# EAGLE design Tweetronic_Relay_Board (EAGLE 7.1.0)
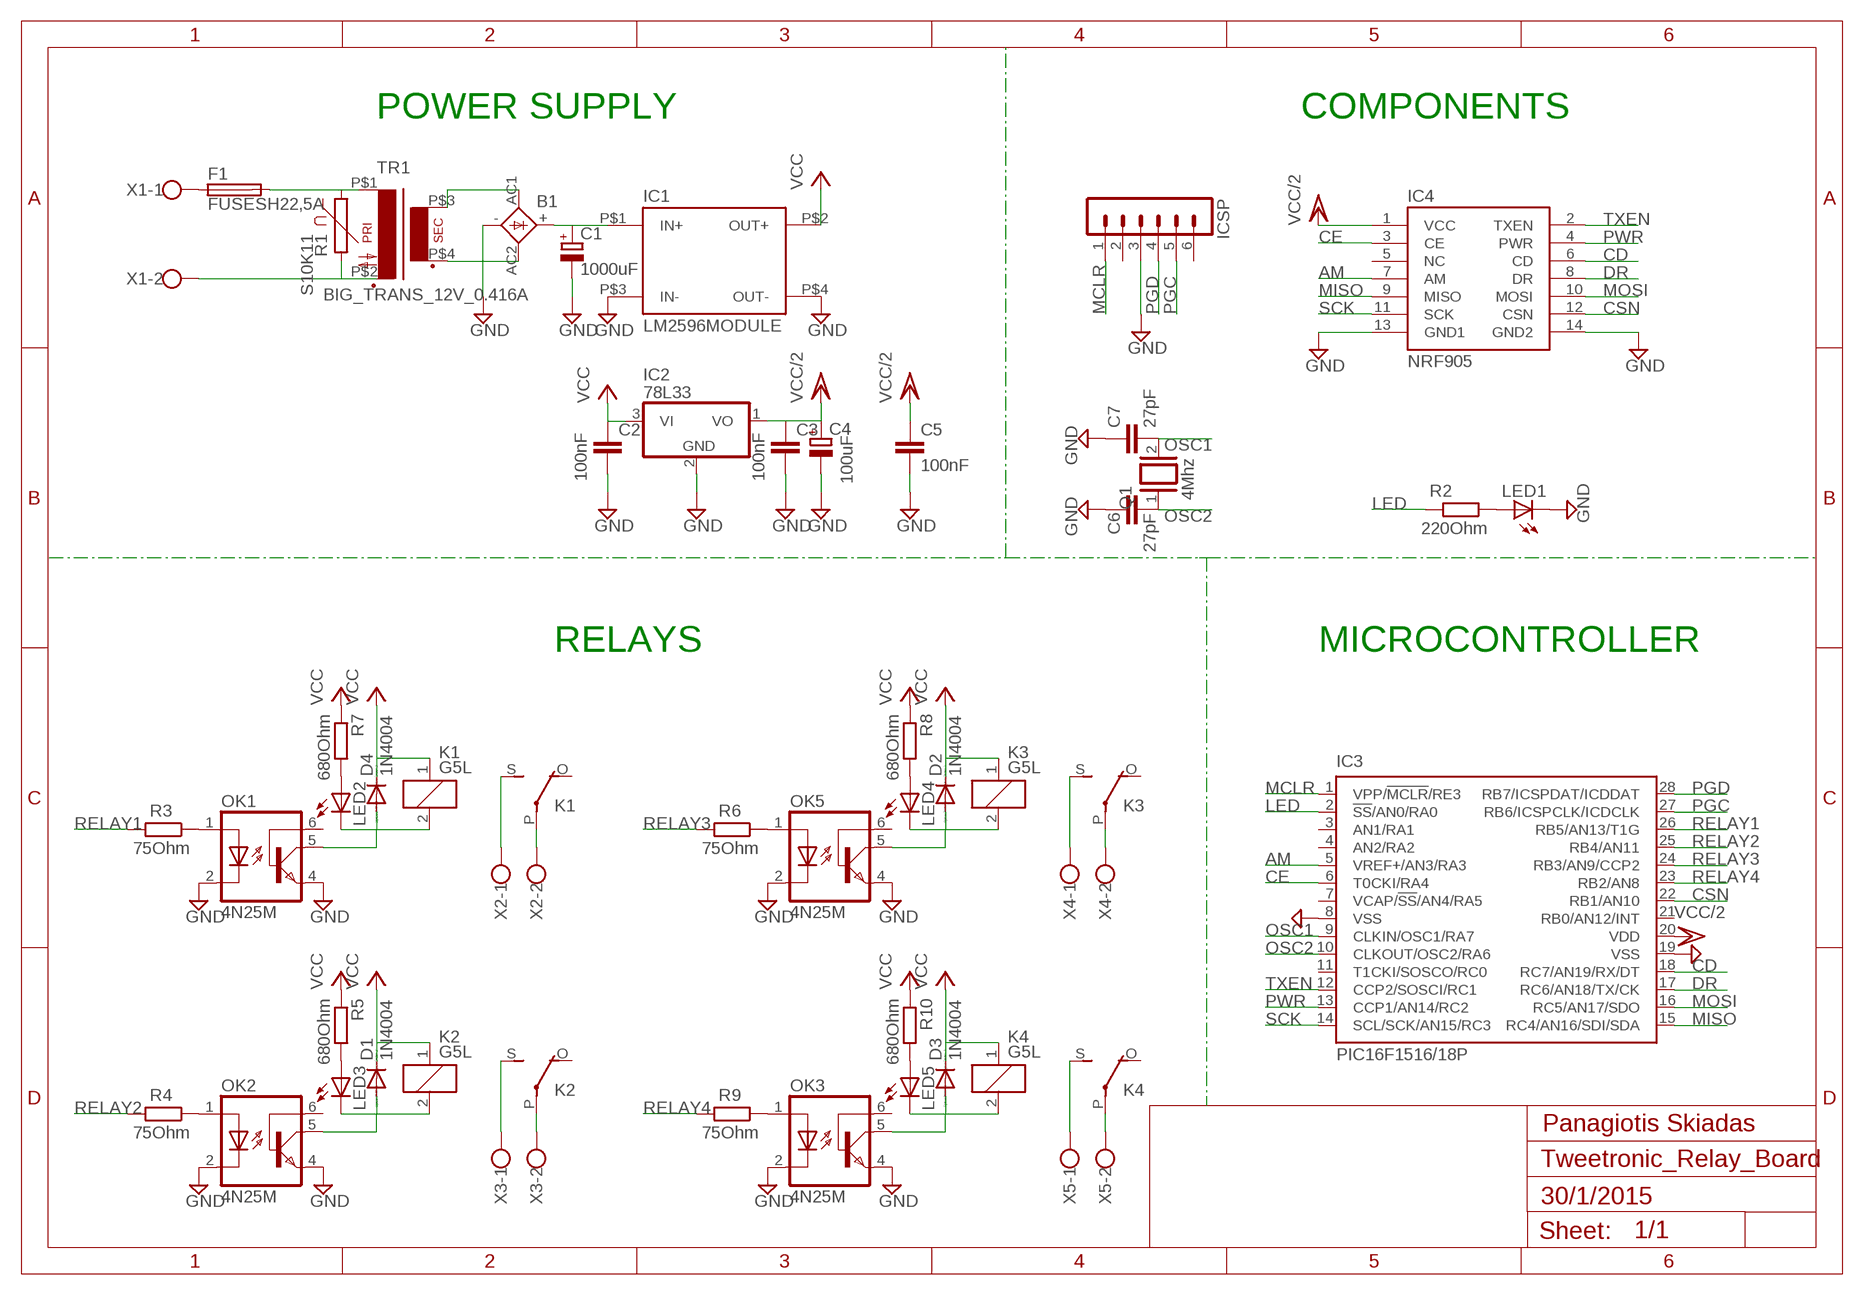
[diagram p0: schematic, sheet 1]

## Parts
B1  1KAB  [1KAB]
C1  1000uF  CPOL-EUE5-13  [E5-13]
C2  100nF  C5/3  [C5B3]
C3  100nF  C5/3  [C5B3]
C4  100uF  CPOL-EUE3.5-8  [E3,5-8]
C5  100nF  C5/3  [C5B3]
C6  27pF  C2,5-3  [C2.5-3]
C7  27pF  C2,5-3  [C2.5-3]
D1  1N4004  [DO41-10]
D2  1N4004  [DO41-10]
D3  1N4004  [DO41-10]
D4  1N4004  [DO41-10]
F1  FUSESH22,5A  [SH22,5A]
IC1  LM2596MODULE  [MODULE]
IC2  78L33  78L05Z  [TO92]
IC3  PIC16F1516/18P  [DIL28-3]
IC4  NRF905  [2X07]
ICSP  MA06-1  [MA06-1]
K1  G5L  [G5LE]
K2  G5L  [G5LE]
K3  G5L  [G5LE]
K4  G5L  [G5LE]
LED1  LED5MM  [LED5MM]
LED2  LED3MM  [LED3MM]
LED3  LED3MM  [LED3MM]
LED4  LED3MM  [LED3MM]
LED5  LED3MM  [LED3MM]
OK1  4N25M  [DIL06]
OK2  4N25M  [DIL06]
OK3  4N25M  [DIL06]
OK5  4N25M  [DIL06]
Q1  4Mhz  XTAL/S  [QS]
R1  S10K11  [S10K11]
R2  220Ohm  R-EU_0207/10  [0207/10]
R3  75Ohm  R-EU_0207/10  [0207/10]
R4  75Ohm  R-EU_0207/10  [0207/10]
R5  680Ohm  R-EU_0207/10  [0207/10]
R6  75Ohm  R-EU_0207/10  [0207/10]
R7  680Ohm  R-EU_0207/10  [0207/10]
R8  680Ohm  R-EU_0207/10  [0207/10]
R9  75Ohm  R-EU_0207/10  [0207/10]
R10  680Ohm  R-EU_0207/10  [0207/10]
TR1  BIG_TRANS_12V_0.416A  [BIG_TRANSF_12V_0.416A]
X1  W237-102  [W237-102]
X2  W237-102  [W237-102]
X3  W237-102  [W237-102]
X4  W237-102  [W237-102]
X5  W237-102  [W237-102]

## Nets
AM: IC3.5(VREF+/AN3/RA3) IC4.7(AM)
CD: IC3.18(RC7/AN19/RX/DT) IC4.6(CD)
CE: IC3.6(T0CKI/RA4) IC4.3(CE)
CSN: IC3.22(RB1/AN10) IC4.12(CSN)
DR: IC3.17(RC6/AN18/TX/CK) IC4.8(DR)
GND: B1.- C1.- C2.2 C3.2 C4.- C5.2 C6.1 C7.1 IC1.P$3(IN-) IC1.P$4(OUT-) IC2.2(GND) IC3.8(VSS) IC3.19(VSS) IC4.13(GND1) IC4.14(GND2) ICSP.3 LED1.K(C) OK1.2(C) OK1.4(EMI) OK2.2(C) OK2.4(EMI) OK3.2(C) OK3.4(EMI) OK5.2(C) OK5.4(EMI)
LED: IC3.2(!SS!/AN0/RA0) R2.2
MCLR: IC3.1(VPP/!MCLR!/RE3) ICSP.1
MISO: IC3.15(RC4/AN16/SDI/SDA) IC4.9(MISO)
MOSI: IC3.16(RC5/AN17/SDO) IC4.10(MOSI)
N$1: F1.1 X1.1
N$2: F1.2 R1.1 TR1.P$1(P1)
N$3: R1.2 TR1.P$2(P2) X1.2
N$4: B1.AC2 TR1.P$4(S3)
N$5: B1.AC1 TR1.P$3(S4)
N$6: B1.+ C1.+ IC1.P$1(IN+)
N$8: OK5.1(A) R6.1
N$9: LED1.A R2.1
N$10: OK1.1(A) R3.1
N$11: OK2.1(A) R4.1
N$12: D1.A K2.2 LED3.K(C) OK2.5(COL)
N$14: LED3.A R5.2
N$15: K2.S(2:S) X3.1
N$16: K2.P(2:P) X3.2
N$17: D4.A K1.2 LED2.K(C) OK1.5(COL)
N$18: OK3.1(A) R9.1
N$20: LED2.A R7.2
N$21: K1.S(2:S) X2.1
N$22: K1.P(2:P) X2.2
N$23: D2.A K3.2 LED4.K(C) OK5.5(COL)
N$25: LED4.A R8.2
N$26: K3.S(2:S) X4.1
N$27: K3.P(2:P) X4.2
N$29: D3.A K4.2 LED5.K(C) OK3.5(COL)
N$31: LED5.A R10.2
N$32: K4.S(2:S) X5.1
N$33: K4.P(2:P) X5.2
OSC1: C7.2 IC3.9(CLKIN/OSC1/RA7) Q1.2
OSC2: C6.2 IC3.10(CLKOUT/OSC2/RA6) Q1.1
PGC: IC3.27(RB6/ICSPCLK/ICDCLK) ICSP.5
PGD: IC3.28(RB7/ICSPDAT/ICDDAT) ICSP.4
PWR: IC3.13(CCP1/AN14/RC2) IC4.4(PWR)
RELAY1: IC3.26(RB5/AN13/T1G) R3.2
RELAY2: IC3.25(RB4/AN11) R4.2
RELAY3: IC3.24(RB3/AN9/CCP2) R6.2
RELAY4: IC3.23(RB2/AN8) R9.2
SCK: IC3.14(SCL/SCK/AN15/RC3) IC4.11(SCK)
TXEN: IC3.12(CCP2/SOSCI/RC1) IC4.2(TXEN)
VCC: C2.1 D1.C D2.C D3.C D4.C IC1.P$2(OUT+) IC2.3(VI) K1.1 K2.1 K3.1 K4.1 R5.1 R7.1 R8.1 R10.1
VCC/2: C3.1 C4.+ C5.1 IC2.1(VO) IC3.20(VDD) IC4.1(VCC)
Unconnected: IC3.3(AN1/RA1) IC3.4(AN2/RA2) IC3.7(VCAP/!SS!/AN4/RA5) IC3.11(T1CKI/SOSCO/RC0) IC3.21(RB0/AN12/INT) IC4.5(NC) ICSP.2 ICSP.6 K1.O(2:O) K2.O(2:O) K3.O(2:O) K4.O(2:O) OK1.6(BAS) OK2.6(BAS) OK3.6(BAS) OK5.6(BAS)

## Notes on the sheet
- POWER SUPPLY | COMPONENTS
- RELAYS | MICROCONTROLLER
- Panagiotis Skiadas
- 30/1/2015

## Library data of the parts
B1 = rectifier:1KAB: RECTIFIER grid 5,08 x 5,08 mm
C1 C4 = rcl:CPOL-EU: POLARIZED CAPACITOR, European symbol
C2 C3 C5-C7 = capacitor-wima:C: CAPACITOR naming: grid - package width
D1-D4 = diode:1N4004: DIODE general purpose rectifier, 1 A
F1 = fuse:FUSE: Fuse; OC_FARNELL: unknown; OC_NEWARK: unknown
IC1 = lm2596_module:LM2596MODULE
IC2 = 78L33:78*: Positive VOLTAGE REGULATOR Source: http://cache.national.com/ds/LM/LM78L05.pdf http://www.fairchildsemi.com/ds/LM/LM7805.pdf
IC3 = microchip:PIC16*F1516/18: 28/40/44-Pin Flash Microcontrollers with nanoWatt XLP Technology PIC16F1516/1518 AND PIC16LF1516/1518 Source: www.microchip.com PIC16F1516.pdf
IC4 = nrf905:NRF905
ICSP = con-lstb:MA06-1: PIN HEADER; OC_FARNELL: unknown; OC_NEWARK: unknown
K1-K4 = relay:G5L: RELAY 1 x switch, 10 A/120 V AC, 8 A/30 V ADC, Omron; OC_FARNELL: unknown; OC_NEWARK: unknown
LED1-LED5 = led:LED: LED OSRAM: - CHIPLED LG R971, LG N971, LY N971, LG Q971, LY Q971, LO R971, LY R971 LH N974, LH R974 LS Q976, LO Q976, LY Q976 LO Q996 - Hyper CHIPLED LW Q18S LB Q993, LB Q99A, LB R99A - SideLED LS A670, LO A670, LY A670, LG A670, LP A670 LB A673, LV A673, LT A673, LW A673 LH A674 LY A675 LS A676, LA A676, LO A676, LY A676, LW A676 LS A679, LY A679, LG A679 - Hyper Micro SIDELED® LS Y876, LA Y876, LO Y876, LY Y876 LT Y87S - SmartLED LW L88C, LW L88S LB L89C, LB L89S, LG L890 LS L89K, LO L89K, LY L89K LS L896, LA L896, LO L896, LY L896 - TOPLED LS T670, LO T670, LY T670, LG T670, LP T670 LSG T670, LSP T670, LSY T670, LOP T670, LYG T670 LG T671, LOG T671, LSG T671 LB T673, LV T673, LT T673, LW T673 LH T674 LS T676, LA T676, LO T676, LY T676, LB T676, LH T676, LSB T676, LW T676 LB T67C, LV T67C, LT T67C, LS T67K, LO T67K, LY T67K, LW E67C LS E67B, LA E67B, LO E67B, LY E67B, LB E67C, LV E67C, LT E67C LW T67C LS T679, LY T679, LG T679 LS T770, LO T770, LY T770, LG T770, LP T770 LB T773, LV T773, LT T773, LW T773 LH T774 LS E675, LA E675, LY E675, LS T675 LS T776, LA T776, LO T776, LY T776, LB T776 LHGB T686 LT T68C, LB T68C - Hyper Mini TOPLED® LB M676 - Mini TOPLED Santana® LG M470 LS M47K, LO M47K, LY M47K Source: http://www.osram.convergy.de LUXEON: - LUMILED® LXK2-PW12-R00, LXK2-PW12-S00, LXK2-PW14-U00, LXK2-PW14-V00 LXK2-PM12-R00, LXK2-PM12-S00, LXK2-PM14-U00 LXK2-PE12-Q00, LXK2-PE12-R00, LXK2-PE12-S00, LXK2-PE14-T00, LXK2-PE14-U00 LXK2-PB12-K00, LXK2-PB12-L00, LXK2-PB12-M00, LXK2-PB14-N00, LXK2-PB14-P00, LXK2-PB14-Q00 LXK2-PR12-L00, LXK2-PR12-M00, LXK2-PR14-Q00, LXK2-PR14-R00 LXK2-PD12-Q00, LXK2-PD12-R00, LXK2-PD12-S00 LXK2-PH12-R00, LXK2-PH12-S00 LXK2-PL12-P00, LXK2-PL12-Q00, LXK2-PL12-R00 Source: www.luxeon.com KINGBRIGHT: KA-3528ASYC Source: www.kingbright.com
OK1-OK3 OK5 = optocoupler:4N*?M: General Purpose 6-Pin Phototransistor Optocouplers Source: http://www.fairchildsemi.com/ds/4N/4N35-M.pdf; MPN: 4N25-M; OC_FARNELL: 1021349; OC_NEWARK: 98K9084
Q1 = special:XTAL/S: CRYSTAL
R1 = varistor:S10K11: VARISTOR
R2-R10 = rcl:R-EU_: RESISTOR, European symbol
TR1 = trafo:BIG_TRANS_12V_0.416A
X1-X5 = con-wago-500:W237-102: WAGO SCREW CLAMP; MPN: 237-102; OC_FARNELL: unknown; OC_NEWARK: 70K9898

## Board
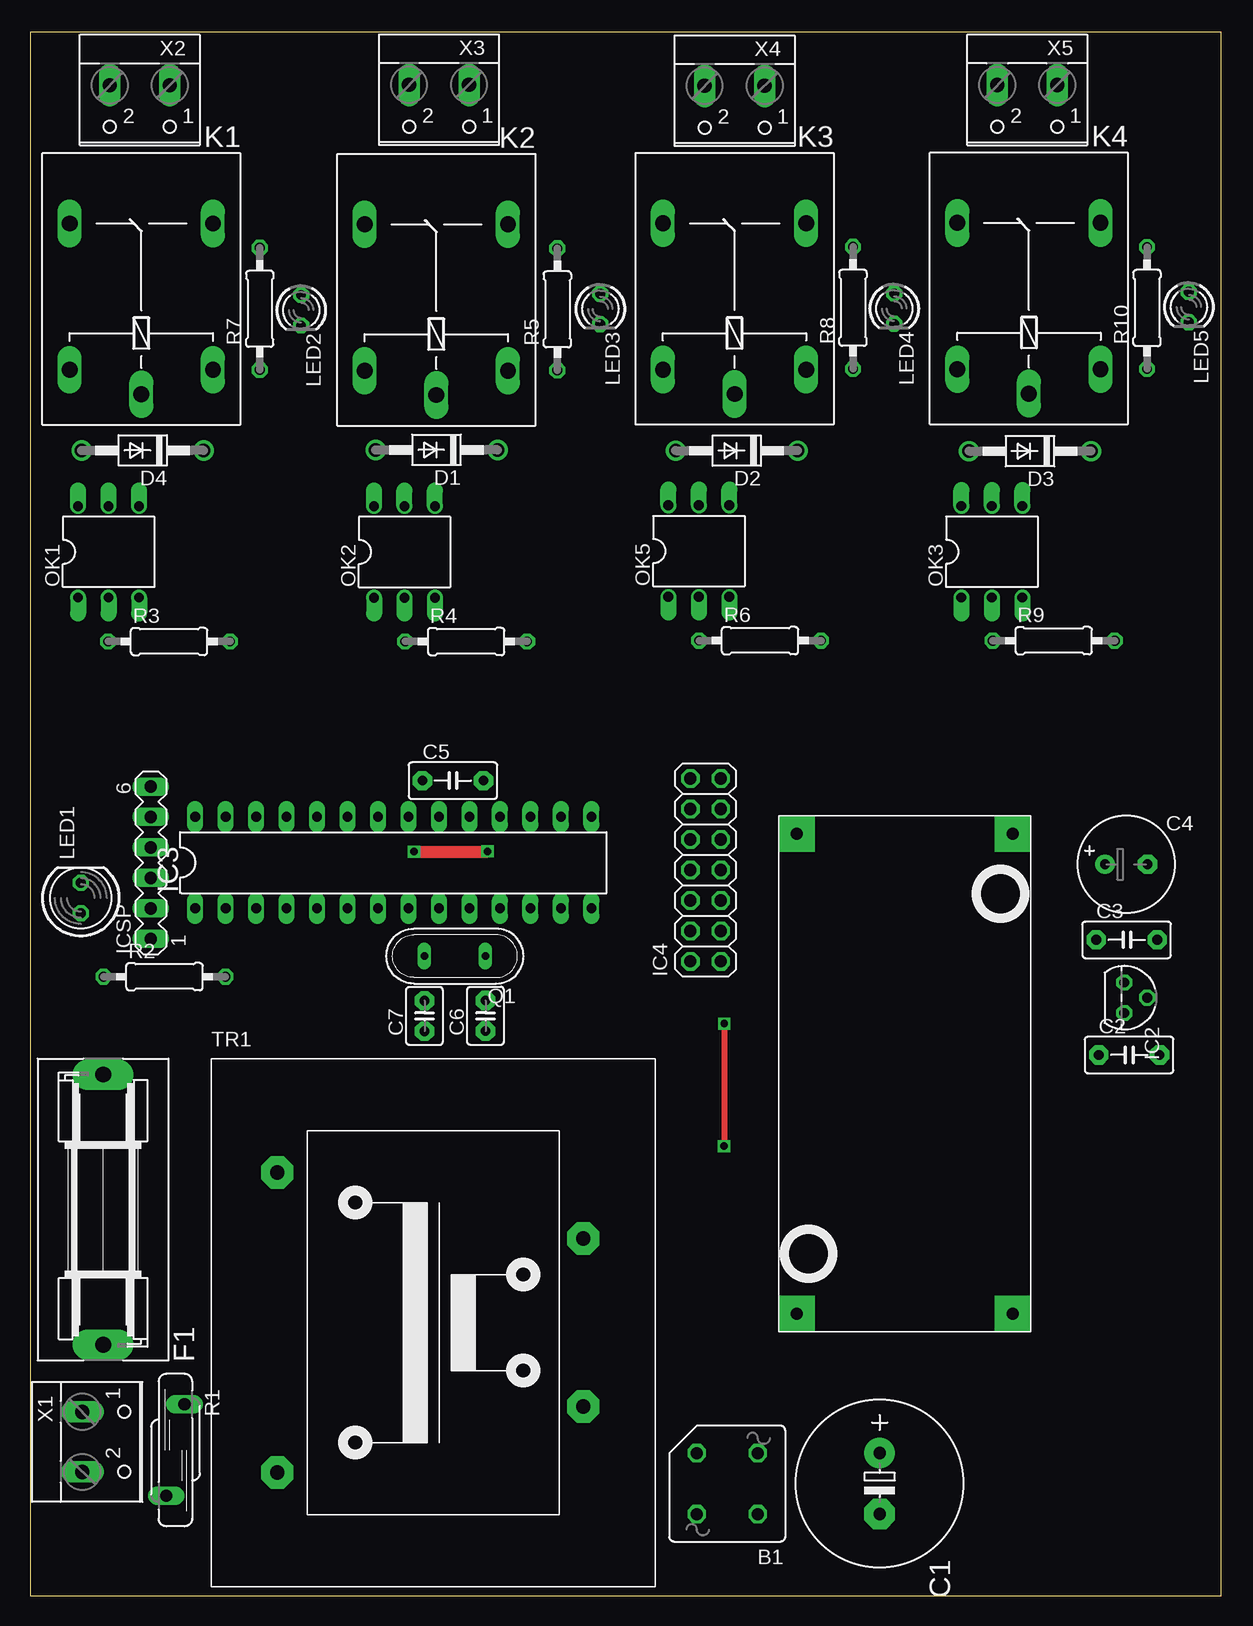
[diagram p1: board, top side]
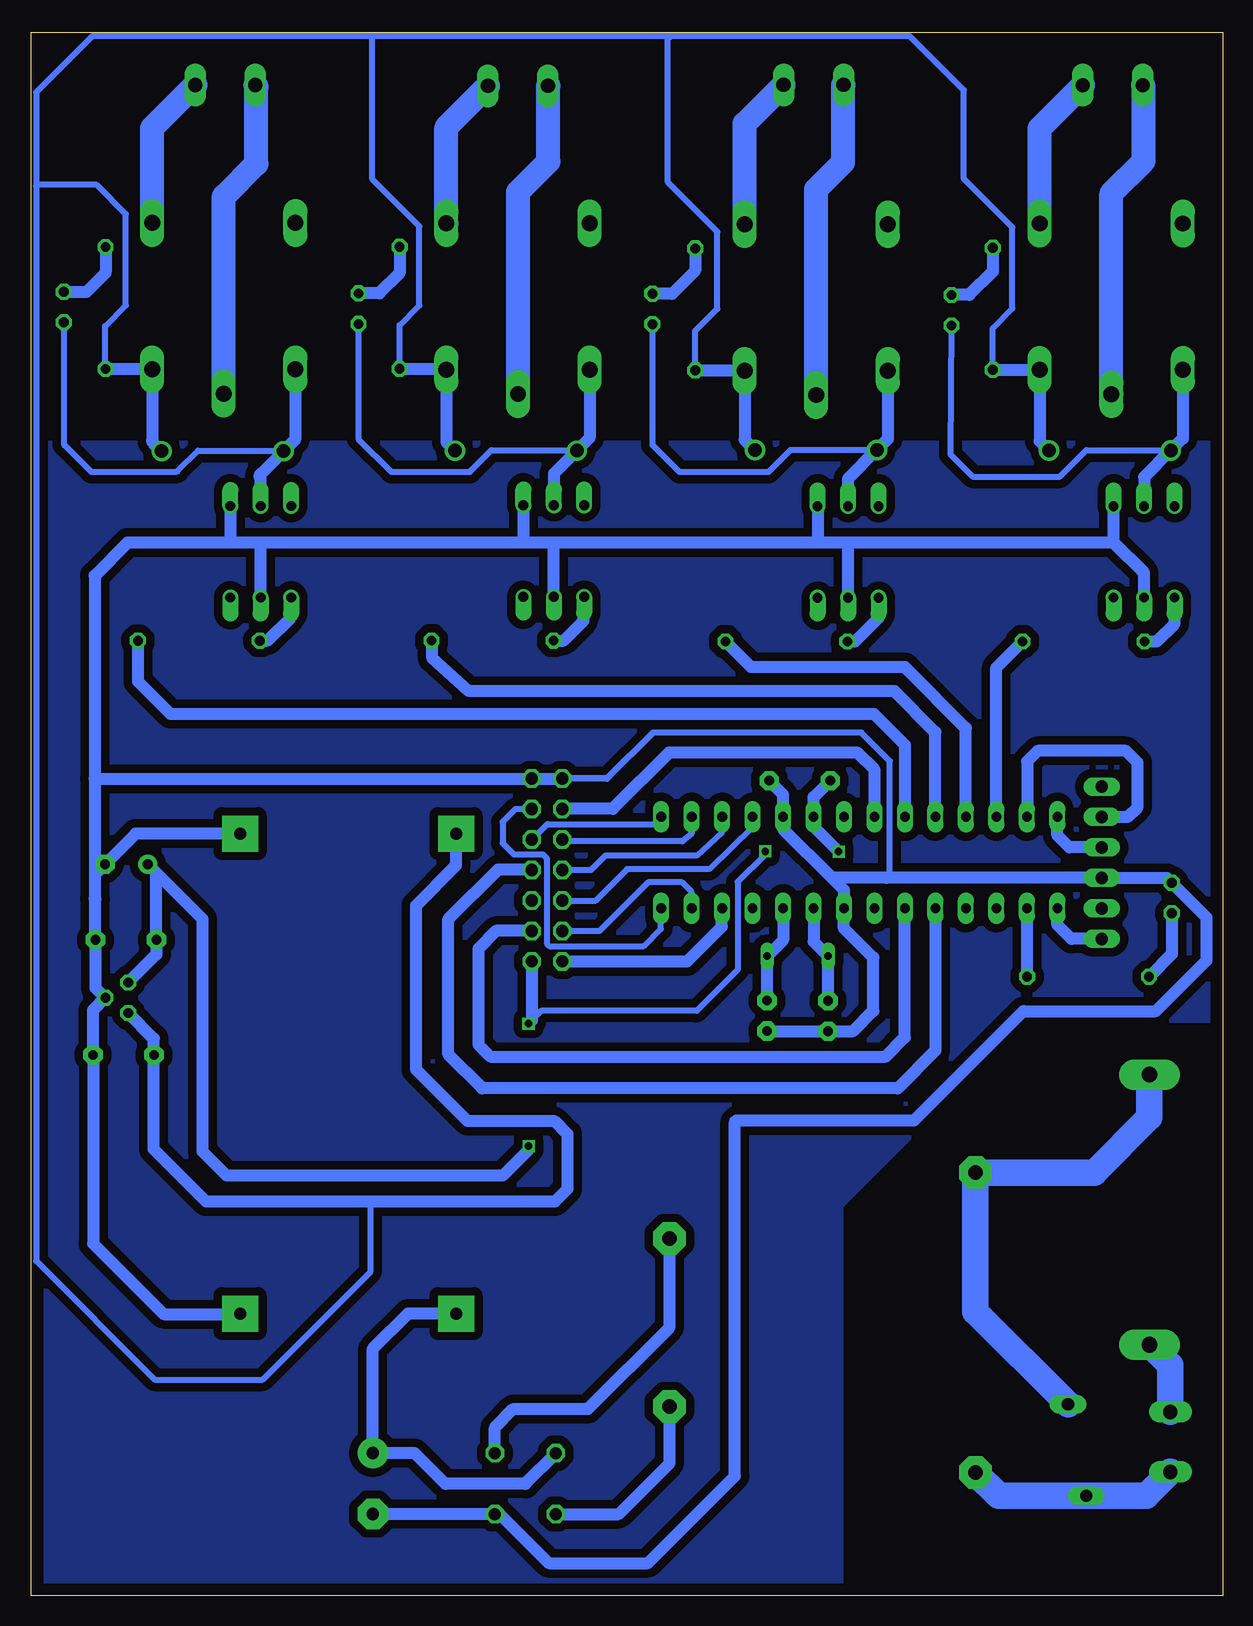
[diagram p2: board, bottom side, seen from below]

Size 99.29 x 130.29 mm. Coordinates in mm from the lower left corner, seen from the top.
Outline: 0,0 99.29,0 99.29,130.29 0,130.29 0,0
Copper layers (1*16): Top 0.035mm / dielectric 1.5mm / Bottom 0.035mm
Design rules "default": minimum track width 10mil, minimum drill 24mil, track to track 8mil, track to pad 8mil, pad to pad 8mil, via to via 8mil, smd to smd 8mil, copper to edge 40mil, drill to drill 8mil, minimum pad ring 10mil, minimum via ring 8mil, stop-mask expansion 4mil, vias tented up to drill 0mil, thermal gap 10mil

### Footprints (pad centres in the part's own frame; a part is rotated, then mirrored left to right if it is on the bottom)
1KAB = drill 1.016 octagon: + 2.54,-2.54; - -2.54,2.54; AC1 -2.54,-2.54; AC2 2.54,2.54
E5-13 = drill 1.016 pad 2.54: + -2.54,0 | drill 1.016 pad 2.54 octagon: - 2.54,0
C5B3 = drill 0.813 pad 1.6 octagon: 1 -2.54,0; 2 2.54,0
E3,5-8 = drill 0.813 pad 1.6: + -1.778,0 | drill 0.813 pad 1.6 octagon: - 1.778,0
C2.5-3 = drill 0.813 pad 1.6 octagon: 1 -1.27,0; 2 1.27,0
DO41-10 = drill 1.118: A 5.08,0; C -5.08,0
SH22,5A = drill 1.321 pad 2.54 long: 1 -11.252,0; 2 11.252,0
MODULE = drill 1 pad 3 square: P$1 -20.04,9.39; P$2 19.96,9.39; P$3 -20.04,-8.61; P$4 19.96,-8.61
TO92 = drill 0.813 octagon: 1 -1.27,0; 2 0,1.905; 3 1.27,0
DIL28-3 = drill 0.813 long: 1 -16.51,-3.81; 2 -13.97,-3.81; 3 -11.43,-3.81; 4 -8.89,-3.81; 5 -6.35,-3.81; 6 -3.81,-3.81; 7 -1.27,-3.81; 8 1.27,-3.81; 9 3.81,-3.81; 10 6.35,-3.81; 11 8.89,-3.81; 12 11.43,-3.81; 13 13.97,-3.81; 14 16.51,-3.81; 15 16.51,3.81; 16 13.97,3.81; 17 11.43,3.81; 18 8.89,3.81; 19 6.35,3.81; 20 3.81,3.81; 21 1.27,3.81; 22 -1.27,3.81; 23 -3.81,3.81; 24 -6.35,3.81; 25 -8.89,3.81; 26 -11.43,3.81; 27 -13.97,3.81; 28 -16.51,3.81
2X07 = drill 1.016 octagon: 1 -7.62,-1.27; 2 -7.62,1.27; 3 -5.08,-1.27; 4 -5.08,1.27; 5 -2.54,-1.27; 6 -2.54,1.27; 7 0,-1.27; 8 0,1.27; 9 2.54,-1.27; 10 2.54,1.27; 11 5.08,-1.27; 12 5.08,1.27; 13 7.62,-1.27; 14 7.62,1.27
MA06-1 = drill 1.016 long: 1 -6.35,0; 2 -3.81,0; 3 -1.27,0; 4 1.27,0; 5 3.81,0; 6 6.35,0
G5LE = drill 1.321 long: 1 -7.493,-5.969; 2 -7.493,5.969; O 4.699,5.969; P -9.525,0; S 4.699,-5.969
LED5MM = drill 0.813 octagon: A -1.27,0; K 1.27,0
LED3MM = drill 0.813 octagon: A -1.27,0; K 1.27,0
DIL06 = drill 0.813 offset: 1 -2.54,-3.81; 2 0,-3.81; 3 2.54,-3.81; 4 2.54,3.81; 5 0,3.81; 6 -2.54,3.81
QS = drill 0.61 long: 1 -2.54,0; 2 2.54,0
S10K11 = drill 1.016 long: 1 -0.762,-3.81; 2 0.762,3.81
0207/10 = drill 0.813 octagon: 1 -5.08,0; 2 5.08,0
BIG_TRANSF_12V_0.416A = drill 1.2 pad 2.7 octagon: P$1 -13.5,12.5; P$2 -13.5,-12.5; P$3 12,7; P$4 12,-7
W237-102 = drill 1.194 long: 1 -2.5,-1.27; 2 2.5,-1.27

### Placement (x,y rotation side)
B1  58.1,9.33 180 top
C1  70.81,9.34 270 top
C2  91.59,45.05 0 top
C3  91.39,54.64 0 top
C4  91.35,60.94 0 top
C5  35.24,67.91 0 top
C6  37.96,48.31 90 top
C7  32.88,48.3 90 top
D1  33.88,95.47 180 top
D2  58.89,95.41 180 top
D3  83.33,95.36 180 top
D4  9.39,95.42 180 top
F1  6.09,32.16 90 top
IC1  73.27,43.52 90 top
IC2  91.2,49.82 270 top
IC3  30.27,61.08 0 top
IC4  56.3,60.47 90 top
ICSP  10.07,61.07 90 top
K1  9.28,109.64 90 top
K2  33.86,109.57 90 top
K3  58.72,109.66 90 top
K4  83.24,109.69 90 top
LED1  4.24,58.13 90 top
LED2  22.59,107.11 270 top
LED3  47.52,107.22 270 top
LED4  72.01,107.24 270 top
LED5  96.56,107.37 270 top
OK1  6.55,86.97 0 top
OK2  31.21,86.97 0 top
OK3  80.15,86.98 0 top
OK5  55.74,87.04 0 top
Q1  35.41,53.28 180 top
R1  12.12,12.12 180 top
R2  11.21,51.57 0 top
R3  11.59,79.51 0 top
R4  36.35,79.5 0 top
R5  43.95,107.18 90 top
R6  60.84,79.58 0 top
R7  19.14,107.23 90 top
R8  68.58,107.31 90 top
R9  85.31,79.57 0 top
R10  93.09,107.3 90 top
TR1  34.1,22.74 0 top
X1  5.63,12.81 270 top
X2  9.15,124.59 180 top
X3  34.09,124.62 180 top
X4  58.72,124.54 180 top
X5  83.11,124.61 180 top

### Tracks (layer width: path | path; a pad name or v marks a point on that pad's centre or on a via)
AM
  Bottom 1: IC3.5 23.93,45.42 27.08,42.27 61.71,42.27 64.52,45.08 64.52,56.38 60.38,60.52 57.62,60.52 IC4.7
CD
  Bottom 0.5: IC3.18 39.16,64.05 42.79,60.53 49.62,60.53 52.24,57.91 55.02,57.91 IC4.6
CE
  Bottom 1: IC4.3 60.55,55.38 62.02,53.91 62.02,45.91 61.02,44.91 28.07,44.91 26.48,46.51 26.48,57.26 IC3.6
CSN
  Bottom 1: IC3.22 29,68.8 30.45,70.24 46.13,70.24 50.82,65.55 IC4.12
DR
  Bottom 0.5: IC3.17 41.7,63.61 43.82,61.66 51.43,61.66 52.62,60.46 IC4.8
GND
  Bottom 0.5: 28,59.8 27.72,60.08 27.72,69.53 30.11,71.92 47.44,71.92 | 47.44,71.92 51.3,68.06 55,68.06 IC4.14 | 47.44,71.92 47.48,71.92 51.3,68.1 54.97,68.1 55.04,68.03
  Bottom 1: C5.2 36.62,66.75 IC3.19 36.59,64.86 36.59,63.82 32.57,59.8 | IC3.8 31.55,58 | 31.55,58 31.55,58.77 32.57,59.8 | 32.57,59.8 28,59.8 ICSP.3 4.64,59.8 LED1.K 1.32,56.49 1.32,52.94 5.57,48.7 16.6,48.7 25.7,39.6 40.51,39.6 40.65,39.46 40.65,9.96 47.9,2.71 56.17,2.71 60.25,6.79 B1.- 70.8,6.79 C1.- | C6.1 C7.1 30.8,47.03 29.11,48.72 29.11,53.16 31.55,55.61 31.55,57.99 31.55,58 | IC4.13 IC4.14 | IC1.P$3 81.91,23.46 88.25,23.46 94.13,29.34 C2.2 94.13,48.79 IC2.2 93.93,50.65 C3.2 93.93,58 | 93.93,58 93.93,60.14 C4.- 90.59,63.48 IC1.P$4 | 94,68.09 94,85 91.26,87.74 83,87.74 | 94,68.09 94,58.07 93.93,58 | 55.04,68.03 93.94,68.03 94,68.09 | 9.07,87.74 9.07,87.7 6.55,85.17 OK1.2 6.55,85.22 9.07,87.74 | 9.07,87.74 9.07,90.77 OK1.4 | 9.07,87.74 31,87.74 | 31,87.74 34,87.74 | 34,87.74 56,87.74 | 56,87.74 58,87.74 | 58,87.74 80,87.74 | 80,87.74 83,87.74 | OK3.2 80.15,87.59 80,87.74 | OK3.4 82.69,88.05 83,87.74 | OK5.2 55.74,87.48 56,87.74 | OK5.4 58.28,88.02 58,87.74 | OK2.2 31.21,87.53 31,87.74 | OK2.4 33.75,87.99 34,87.74
LED
  Bottom 1: R2.2 IC3.2
MCLR
  Bottom 1: ICSP.1 12.59,54.72 13.77,55.89 IC3.1
MISO
  Bottom 0.5: IC4.9 57.54,63.01 56.26,64.28 47.4,64.28 IC3.15
MOSI
  Bottom 0.5: IC3.16 44.24,63.48 45.02,62.85 54.88,62.85 IC4.10 55.02,62.99
N$1
  Bottom 2.2: X1.1 4.36,19.18 F1.1
N$2
  Bottom 2.2: R1.1 20.6,23.65 TR1.P$1 10.7,35.24 6.1,39.84 F1.2
N$3
  Bottom 2.2: TR1.P$2 18.67,8.31 R1.2 6.35,8.31 X1.2
N$4
  Bottom 1: B1.AC2 50.34,6.79 46.08,11.04 46.08,15.73 TR1.P$4
N$5
  Bottom 1: B1.AC1 60.65,14 59.09,15.55 52.9,15.55 46.08,22.37 46.08,29.73 TR1.P$3
N$6
  Bottom 1: B1.+ 55.56,11.83 58.1,9.3 64.76,9.3 67.33,11.87 70.8,11.87 C1.+ 70.85,11.92 70.85,20.51 67.88,23.48 IC1.P$1
N$7
  pour Bottom (isolate 0.7): 0,96 99.27,96 99.27,0.01 31.82,0.01 31.82,32.46 16.31,47.98 0,47.98
N$8
  Bottom 1: R6.1 54.91,79.58 53.25,81.24 53.25,83.18 OK5.1
N$9
  Bottom 1: LED1.A 4.24,53.47 R2.1
N$10
  Bottom 1: R3.1 5.49,79.51 4,81 OK1.1
N$11
  Bottom 1: R4.1 30.63,79.5 28.68,81.45 28.68,83.14 OK2.1
N$12
  Bottom 0.5: LED3.K 47.52,95.88 45.28,93.64 37.83,93.64 36.01,95.47 D1.A
  Bottom 1: K2.2 27.89,96.38 D1.A 31.21,93.06 31.21,93.05 OK2.5
N$14
  Bottom 1: R5.2 43.95,110.41 45.88,108.48 47.51,108.48 LED3.A
N$15
  Bottom 2: K2.S 39.83,122.65 X3.1
N$16
  Bottom 2: K2.P 33.86,117.19 31.62,119.43 31.62,125.86 X3.2
N$17
  Bottom 0.5: LED2.K 22.68,95.09 20.84,93.24 13.56,93.24 11.36,95.44 4.33,95.44 D4.A
  Bottom 1: K1.2 3.31,96.42 D4.A 6.53,93.2 6.53,90.8 OK1.5
N$18
  Bottom 1: R9.1 79.6,79.57 77.63,81.54 77.63,83.16 OK3.1
N$20
  Bottom 1: R7.2 19.14,110.33 21.1,108.38 LED2.A
N$21
  Bottom 2: K1.S 15.25,122.27 X2.1
N$22
  Bottom 2: K1.P 9.28,116.84 6.58,119.54 6.58,125.79 X2.2
N$23
  Bottom 0.5: LED4.K 72.01,96.37 69.28,93.64 62.74,93.64 60.94,95.44 53.85,95.44 D2.A
  Bottom 1: K3.2 52.75,96.47 D2.A 55.73,93.48 OK5.5
N$25
  Bottom 1: R8.2 68.58,110.2 70.28,108.51 LED4.A
N$26
  Bottom 2: K3.S 64.68,122.35 X4.1
N$27
  Bottom 2: K3.P 58.72,116.97 56.19,119.5 56.19,125.78 X4.2
N$29
  Bottom 0.5: LED5.K 96.56,96.03 arc-45 96.49,95.85 94.28,93.64 87.25,93.64 arc-45 87.08,93.72 85.38,95.41 78.37,95.41 arc45 D3.A
  Bottom 1: K4.2 77.27,96.45 arc45 77.34,96.27 D3.A 80.17,93.45 arc-45 80.24,93.27 80.15,93.19 OK3.5
N$31
  Bottom 1: R10.2 93.09,110.33 arc45 93.16,110.15 94.69,108.62 96.52,108.62 arc45 LED5.A
N$32
  Bottom 2: K4.S 89.21,122.17 arc45 89.14,122.35 X5.1
N$33
  Bottom 2: K4.P 83.24,116.47 arc45 83.17,116.65 80.52,119.3 80.52,125.69 arc-45 80.59,125.87 X5.2
OSC1
  Bottom 1: IC3.9 34.09,54.49 Q1.2 C7.2
OSC2
  Bottom 1: IC3.10 36.62,54.61 Q1.1 C6.2
PGC
  Bottom 1: ICSP.5 7.91,64.88 7.08,65.71 7.08,69.41 8.06,70.4 15.41,70.4 16.3,69.51 16.3,64.9 IC3.27
PGD
  Bottom 1: ICSP.4 12.76,62.34 13.78,63.35 13.78,64.88 IC3.28
PWR
  Bottom 0.5: IC3.13 44.24,58.63 45.04,59.42 47.87,59.42 51.91,55.38 IC4.4
RELAY1
  Bottom 1: IC3.26 18.84,77.33 R3.2
RELAY2
  Bottom 1: IC3.25 21.39,72.29 26.33,77.24 26.33,77.25 26.45,77.37 39.29,77.37 R4.2
RELAY3
  Bottom 1: IC3.24 23.93,71.96 27.33,75.36 62.81,75.36 65.86,78.1 65.86,79.52 R6.2
RELAY4
  Bottom 1: IC3.23 26.46,70.87 28.97,73.37 29.06,73.46 87.67,73.46 90.37,76.16 90.37,79.55 R9.2
SCK
  Bottom 0.5: IC4.11 58.93,65.55 60,64.47 60,62.71 59.05,61.76 56.64,61.76 56.3,61.42 56.3,54.32 56.09,54.11 48.25,54.11 46.81,55.55 46.81,57.25 IC3.14
TXEN
  Bottom 1: IC4.2 44.63,52.84 41.73,55.74 41.73,57.25 IC3.12
VCC
  Bottom 0.5: R7.1 19.14,105.63 17.51,107.26 17.51,114.01 21.56,118.05 21.56,125.44 26.08,129.96 46,129.96 | 46,129.96 71,129.96 | 71,129.96 94.18,129.96 98.88,125.25 98.88,117.47 | 98.88,117.47 98.88,27.88 89,18 80,18 71,27 71,32.82 | R5.1 43.95,105.39 42.11,107.23 42.11,113.64 46.23,117.77 46.23,129.73 46,129.96 | R8.1 68.58,105.86 66.94,107.5 66.94,114.1 70.85,118.01 70.85,129.81 71,129.96 | K4.1 93.1,102.2 93.12,102.21 93.12,105.79 91.4,107.5 91.4,115.12 93.83,117.55 98.8,117.55 98.88,117.47
  Bottom 1: D4.C 15.25,96.2 K1.1 R7.1 | D1.C 39.83,96.33 K2.1 39.86,102.1 R5.1 | D2.C 64.68,96.12 K3.1 64.75,102.23 R8.1 | D3.C 89.14,96.08 arc45 89.21,96.26 K4.1 arc-45 89.26,102.22 R10.1 | IC2.3 89.05,46.41 C2.1 89.09,45.01 89.09,37.19 84.71,32.82 71,32.82 55.64,32.82 54.6,33.86 54.6,38.44 55.7,39.55 62.94,39.55 67.23,43.84 67.23,57.5 63.88,60.85 IC1.P$2
VCC/2  (via drill 0.6)
  Top 0.5: v57.84,47.66 57.84,37.47 v57.83,37.46
  Top 1: v32,62 v38.11,62 v38.12,62.01
  Bottom 0.5: v38.12,62.01 38.12,61.75 40.41,59.46 40.41,52.15 43.84,48.72 56.79,48.72 v57.84,47.66 | v57.83,37.46 57.83,37.17
  Bottom 1: IC2.1 88.85,53.44 C3.1 88.85,60.21 C4.+ 85,56.36 85,37 83,35 60,35 57.83,37.17 | C5.1 34.09,66.53 IC3.20 34.09,64.08 v32,62 | IC4.1 57.57,47.94 v57.84,47.66